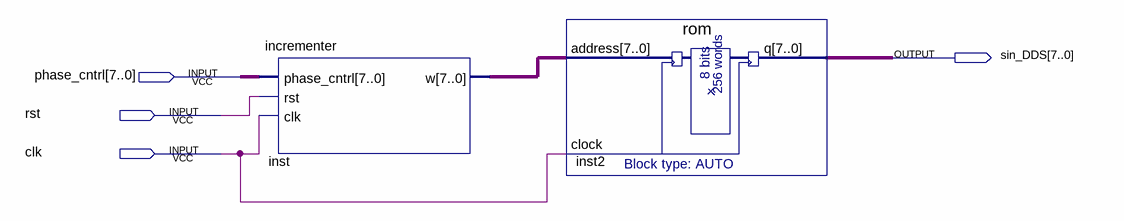
[diagram p0: schematic sheet]
// Quartus schematic DDS.bdf as structural Verilog: 2 symbols, 4 pins
module DDS (
  input  [7:0] phase_cntrl,
  input  rst,
  input  clk,
  output [7:0] sin_DDS
);

  wire [7:0] inst_w;

  incrementer inst (.phase_cntrl(phase_cntrl), .rst(rst), .clk(clk), .w(inst_w));
  rom inst2 (.address(inst_w), .clock(clk), .q(sin_DDS));
endmodule
